# Altium schematic sheet signal_in.SchDoc
size A; SheetNumber: 13; SheetTotal: 13
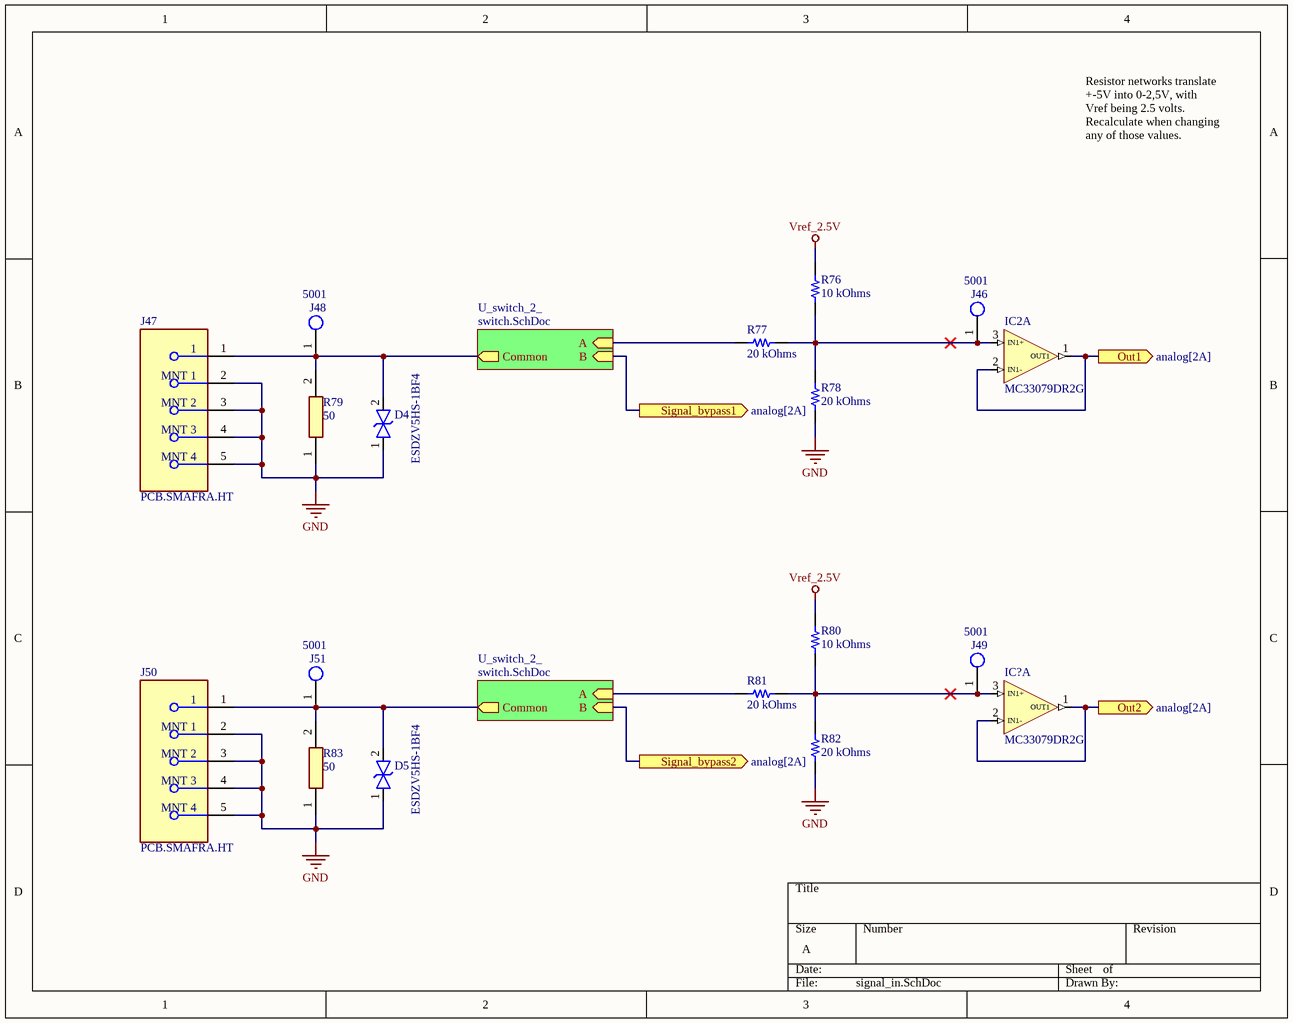
[diagram p0: signal_in.SchDoc]

## Parts
D4  ESDZV5HS-1BF4  [ESDZV5HS1BF4]
D5  ESDZV5HS-1BF4  [ESDZV5HS1BF4]
IC2  MC33079DR2G  [SOIC127P600X175-14N]  (part A of 5)
IC?  MC33079DR2G  [SOIC127P600X175-14N]  (part A of 5)
J46  5001  [FP-5001-MFG]
J47  PCB.SMAFRA.HT  [FP-PCB_SMAFRA_HT-MFG]
J48  5001  [FP-5001-MFG]
J49  5001  [FP-5001-MFG]
J50  PCB.SMAFRA.HT  [FP-PCB_SMAFRA_HT-MFG]
J51  5001  [FP-5001-MFG]
R76  10 kOhms  [RES 1206_3216]
R77  20 kOhms  [RES 1206_3216]
R78  20 kOhms  [RES 1206_3216]
R79  50  [RESC6332X65N]
R80  10 kOhms  [RES 1206_3216]
R81  20 kOhms  [RES 1206_3216]
R82  20 kOhms  [RES 1206_3216]
R83  50  [RESC6332X65N]

## Sub-sheets
U_switch_2_ = switch.SchDoc: B (in), A (in), Common (out)
U_switch_2_ = switch.SchDoc: B (in), A (in), Common (out)

## Ports
Out1 (out, see analog[2A]), Out2 (out, see analog[2A]), Signal_bypass1 (out, see analog[2A]), Signal_bypass2 (out, see analog[2A])

## Nets
GND: D4.1 D5.1 J47.2(MNT_1) J47.3(MNT_2) J47.4(MNT_3) J47.5(MNT_4) J50.2(MNT_1) J50.3(MNT_2) J50.4(MNT_3) J50.5(MNT_4) R78.2 R79.1 R82.2 R83.1
Vref_2.5V: R76.1 R80.1
Out1: IC2.1(OUT1) IC2.2(IN1-) ; port Out1
Out2: IC?.1(OUT1) IC?.2(IN1-) ; port Out2
Signal_bypass1: port Signal_bypass1, sheet U_switch_2_/B
Signal_bypass2: port Signal_bypass2, sheet U_switch_2_/B
NetD4_2: D4.2 J47.1 J48.1 R79.2 ; sheet U_switch_2_/Common
NetD5_2: D5.2 J50.1 J51.1 R83.2 ; sheet U_switch_2_/Common
NetIC2_3: IC2.3(IN1+) J46.1 R76.2 R77.2 R78.1
NetIC?_3: IC?.3(IN1+) J49.1 R80.2 R81.2 R82.1
NetR77_1: R77.1 ; sheet U_switch_2_/A
NetR81_1: R81.1 ; sheet U_switch_2_/A

## Notes on the sheet
- Resistor networks translate +-5V into 0-2,5V, with Vref being 2.5 volts. Recalculate when changing any of those values.

## Library data of the parts
D4 D5 = ESDZV5HS-1BF4: TVS Diode (Bi-directional); Manufacturer_Name: STMicroelectronics; Datasheet Link: https://www.st.com/resource/en/datasheet/esdzv5hs-1bf4.pdf; Height: 0.33mm; Manufacturer_Part_Number: ESDZV5HS-1BF4; Mouser Part Number: 511-ESDZV5HS-1BF4; Mouser Price/Stock: https://www.mouser.co.uk/ProductDetail/STMicroelectronics/ESDZV5HS-1BF4?qs=l7cgNqFNU1hPMpLiUWAylw%3D%3D; Arrow Part Number: ESDZV5HS-1BF4; Arrow Price/Stock: https://www.arrow.com/en/products/esdzv5hs-1bf4/stmicroelectronics?region=nac
IC2 IC? = MC33079DR2G: Integrated Circuit; Manufacturer_Name: onsemi; Datasheet Link: https://www.onsemi.com/pub/Collateral/MC33078-D.PDF; Height: 1.75mm; Manufacturer_Part_Number: MC33079DR2G; Mouser Part Number: 863-MC33079DR2G; Mouser Price/Stock: https://www.mouser.co.uk/ProductDetail/onsemi/MC33079DR2G?qs=g2rIOKKlpoa9LEjz5JLClg%3D%3D; Arrow Part Number: MC33079DR2G; Arrow Price/Stock: https://www.arrow.com/en/products/mc33079dr2g/on-semiconductor?region=asia
J46 J48 J49 J51 = CMP-2000-05181-2: PC TEST POINT MINIATURE BLACK; Body Material: Bronze; Plating: Silver; Inside Diameter: 1.27mm; Hole Diameter: 1.6mm; Number of Ports: 1; Outside Diameter: 2.54mm; Insulation: Insulated; Insulation Material: Nylon; Mount: Through Hole; RoHS Compliant: Yes; Series: THM; Height: 0.3inch; Termination: Through Hole; Material: Nylon; Packaging: Bulk; Contact Material: Bronze; REACH SVHC: No SVHC; Contact Plating: Silver; Orientation: Straight; Lead Free: Lead Free; Package Quantity: 100; Length: 7.62mm; Flammability Rating: UL94 V-0; Number of Contacts: 1; Diameter: 2.54mm; Housing Color: Black; Color: Black
J47 J50 = CMP-111093-000003-1: CONN SMA JACK R/A 50OHM PCB; Dielectric Material: PTFE; Max Frequency: 6GHz; Body Material: Brass; Center Contact Plating: Gold; Voltage Rating: 500V; Operating Frequency: 0 to 6 GHz; Number of Ports: 1; Impedance: 50R; Housing Color: Gold; Mount: Through Hole; Orientation: Right Angle; Termination: Solder; Contact Material: Brass; Series: -; Contact Plating: Gold; Fastening Type: Threaded; Connector Type: SMA; Package Quantity: 500; Case/Package: SMA; Body Plating: Gold; Frequency: 6GHz; Packaging: Tray
R76 R80 = ERA-8AEB103V: RES SMD 10K OHM 0.1% 1/4W 1206; Manufacturer: Panasonic Electronic Components; Power (Watts): 0.25W, 1/4W; Temperature Coefficient: ±25ppm/°C; Part Number: ERA-8AEB103V; ComponentLink1Description: Datasheet; ComponentLink1URL: https://industrial.panasonic.com/cdbs/www-data/pdf/RDM0000/AOA0000C307.pdf; ComponentLink2Description: DigiKey Link; ComponentLink2URL: https://www.digikey.com/en/products/detail/panasonic-electronic-components/ERA-8AEB103V/3070742; Composition: Thin Film; Device Package: 1206 (3216 Metric); Features: Automotive AEC-Q200; Height - Seated (Max): 0.028" (0.70mm); LastUpdated: 2/9/2024 20:54:17; Lifecycle Status: Active; Minimum Order: 1; Number of Terminations: 2; Operating Temperature: -55°C ~ 155°C; Package / Case: 1206 (3216 Metric); Packaging: TapeAndReel; PartId: 33990; Part Status: Active; Price: 0.10; Ratings: AEC-Q200; Resistance: 10 kOhms; Series: ERA-8A; Size / Dimension: 0.126" L x 0.063" W (3.20mm x 1.60mm); Supplier 1: DigiKey; Supplier Part Number 1: P10KBCCT-ND; Supplier Device Package: 1206; Tolerance: ±0.1%; Value: 10 kOhms
R77 R78 R81 R82 = ERA-8AEB203V: RES SMD 20K OHM 0.1% 1/4W 1206; Manufacturer: Panasonic Electronic Components; Power (Watts): 0.25W, 1/4W; Temperature Coefficient: ±25ppm/°C; Part Number: ERA-8AEB203V; ComponentLink1Description: Datasheet; ComponentLink1URL: https://industrial.panasonic.com/cdbs/www-data/pdf/RDM0000/AOA0000C307.pdf; ComponentLink2Description: DigiKey Link; ComponentLink2URL: https://www.digikey.com/en/products/detail/panasonic-electronic-components/ERA-8AEB203V/3070867; Composition: Thin Film; Device Package: 1206 (3216 Metric); Features: Automotive AEC-Q200; Height - Seated (Max): 0.028" (0.70mm); LastUpdated: 2/9/2024 20:54:17; Lifecycle Status: Active; Minimum Order: 1; Number of Terminations: 2; Operating Temperature: -55°C ~ 155°C; Package / Case: 1206 (3216 Metric); Packaging: TapeAndReel; PartId: 33988; Part Status: Active; Price: 0.10; Ratings: AEC-Q200; Resistance: 20 kOhms; Series: ERA-8A; Size / Dimension: 0.126" L x 0.063" W (3.20mm x 1.60mm); Supplier 1: DigiKey; Supplier Part Number 1: P20KBCCT-ND; Supplier Device Package: 1206; Tolerance: ±0.1%; Value: 20 kOhms
R79 R83 = RNCL2512FT50R0: Resistor; Manufacturer_Name: Stackpole Electronics; Datasheet Link: https://www.seielect.com/catalog/sei-rncl.pdf; Height: 0.65mm; Manufacturer_Part_Number: RNCL2512FT50R0; Resistance: 50